# EasyEDA Pro project ProPrj_SuperCapTestBoard - 2.1_2024-07-26.epro, schematic Schematic2

## Sheets
1 P1: Create Date: 2024-05-25; Page Name: P1; Project Name: SuperCapTestBoard - 2.1; Schematic Name: Schematic2; Update Date: 2024-05-30; Company: EasyEDA.com; Drawed: EasyEDA Pro; Page Size: A4; Part Number: JLCPCB-002; Reviewed: EasyEDA Pro; Version: V0.1
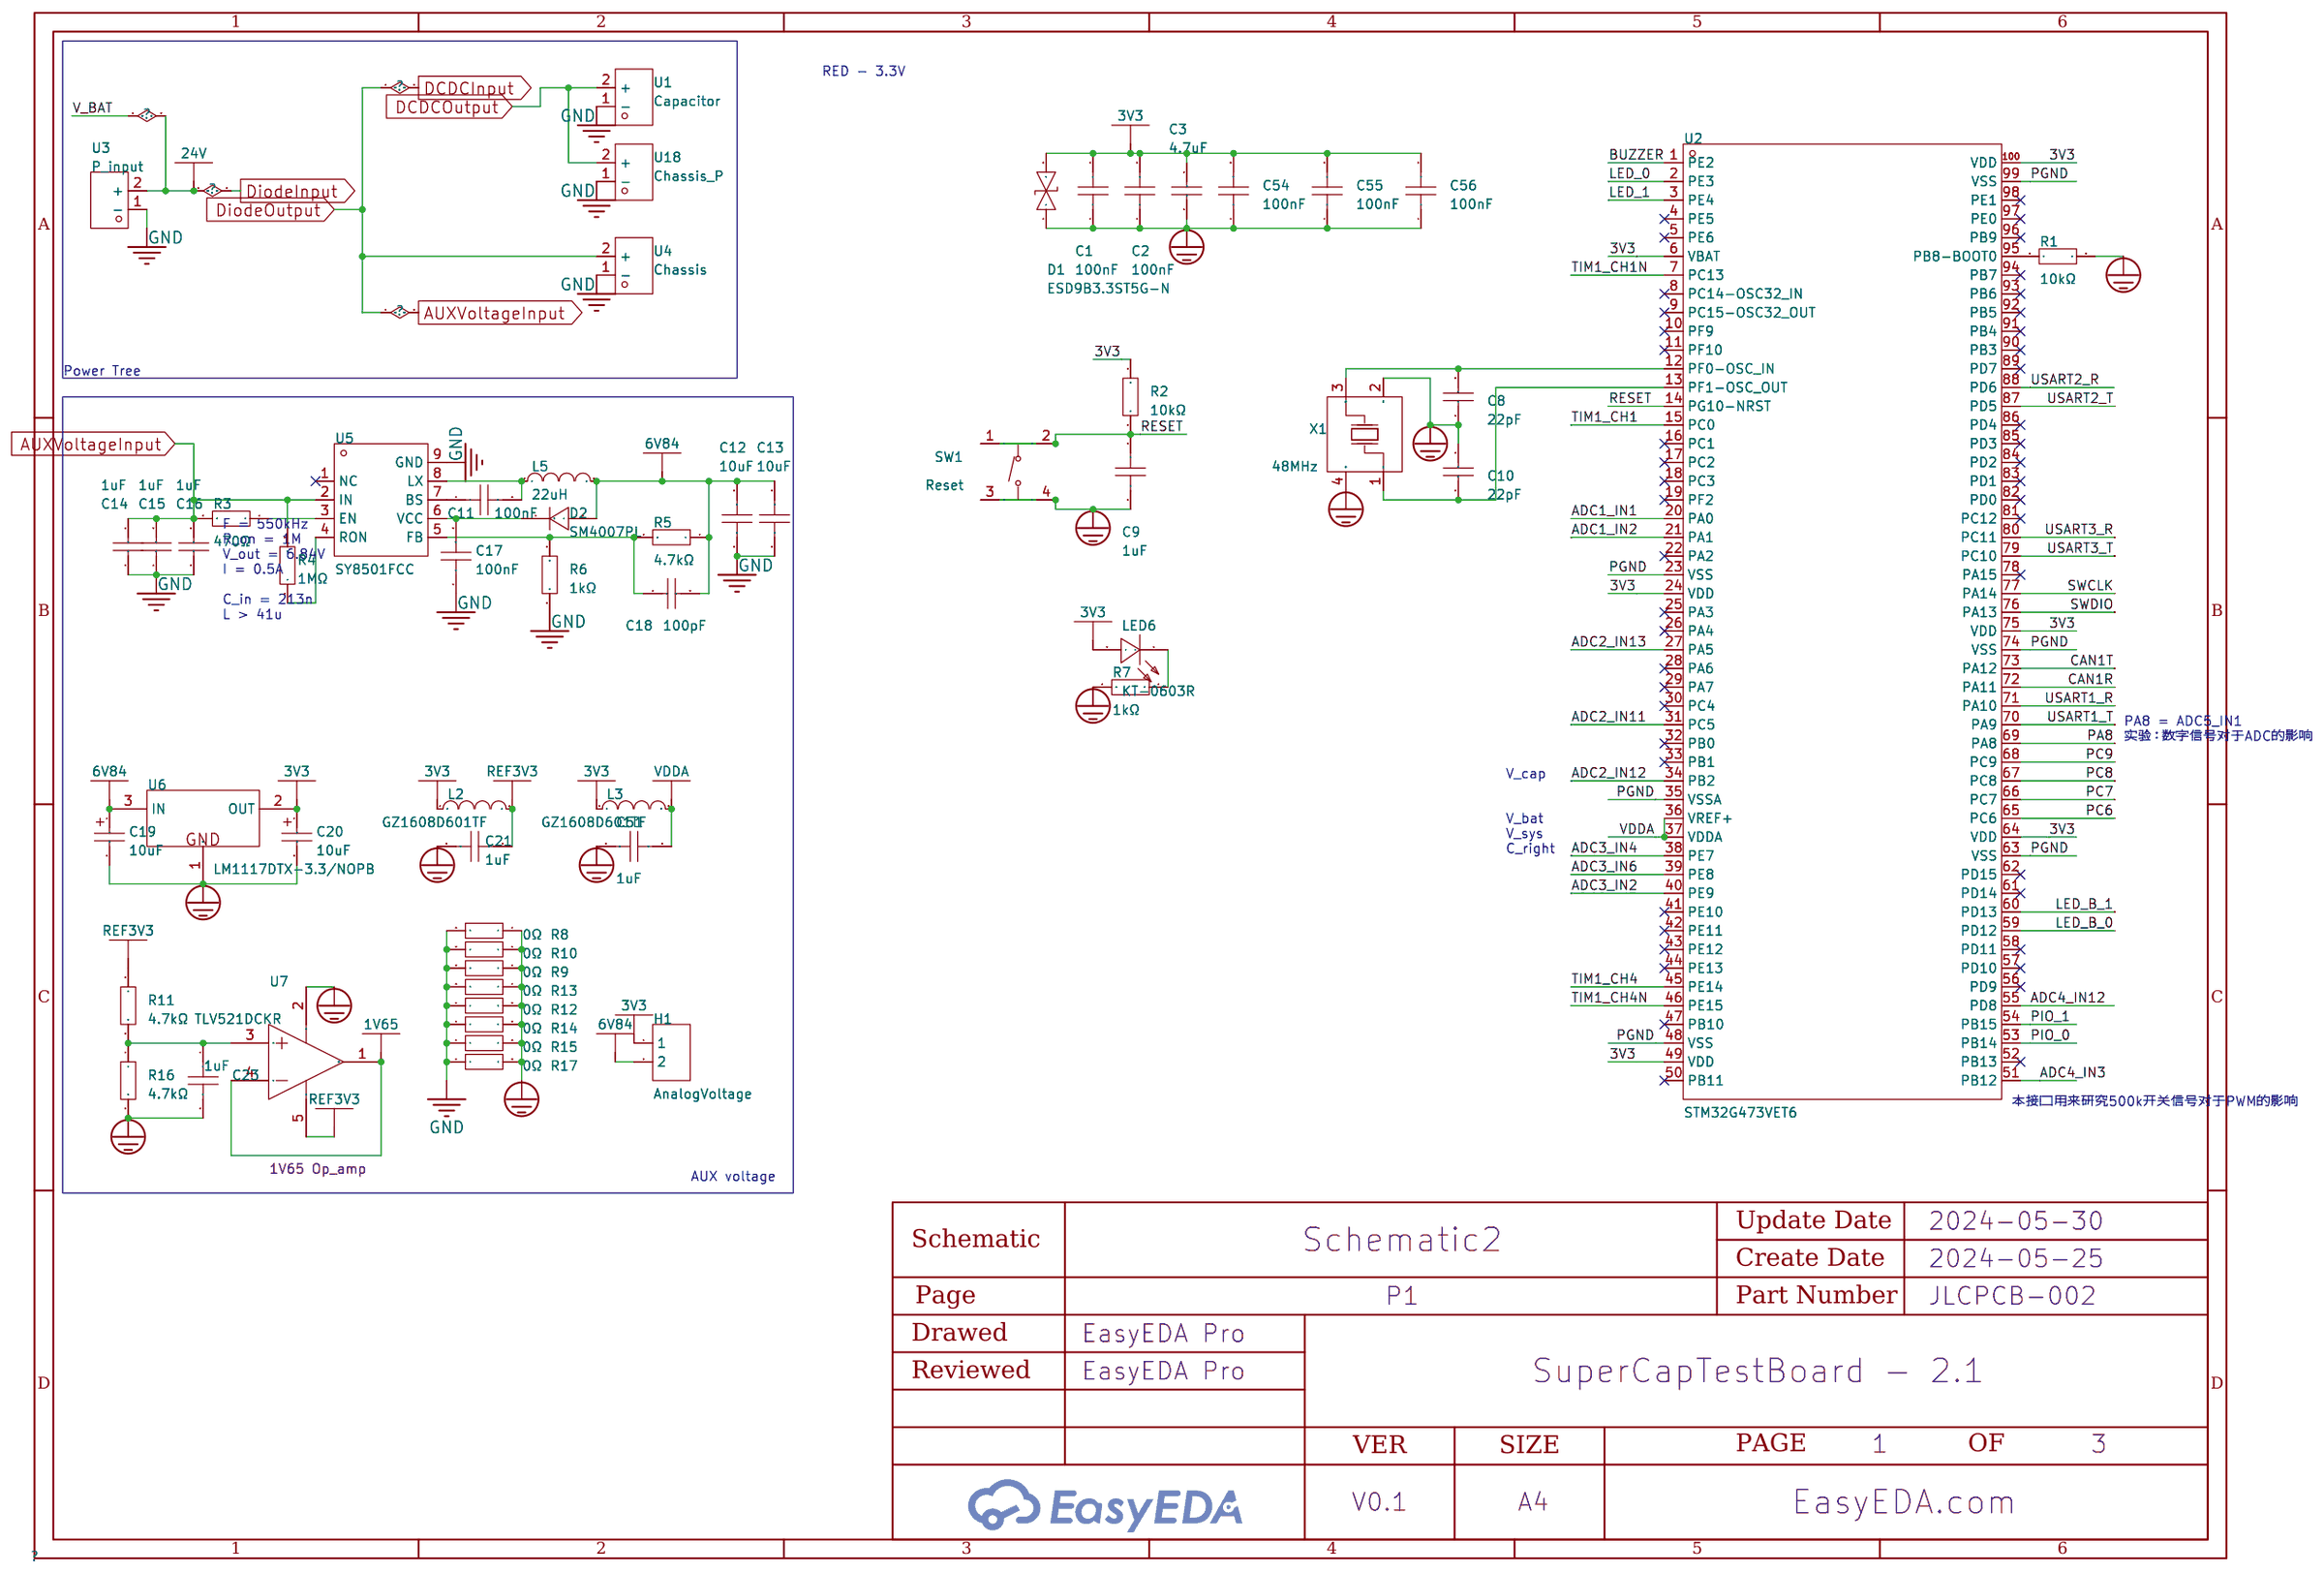
[diagram p0: P1]
2 P2: Page Name: P2.Schematic2; Update Date: 2024-05-31
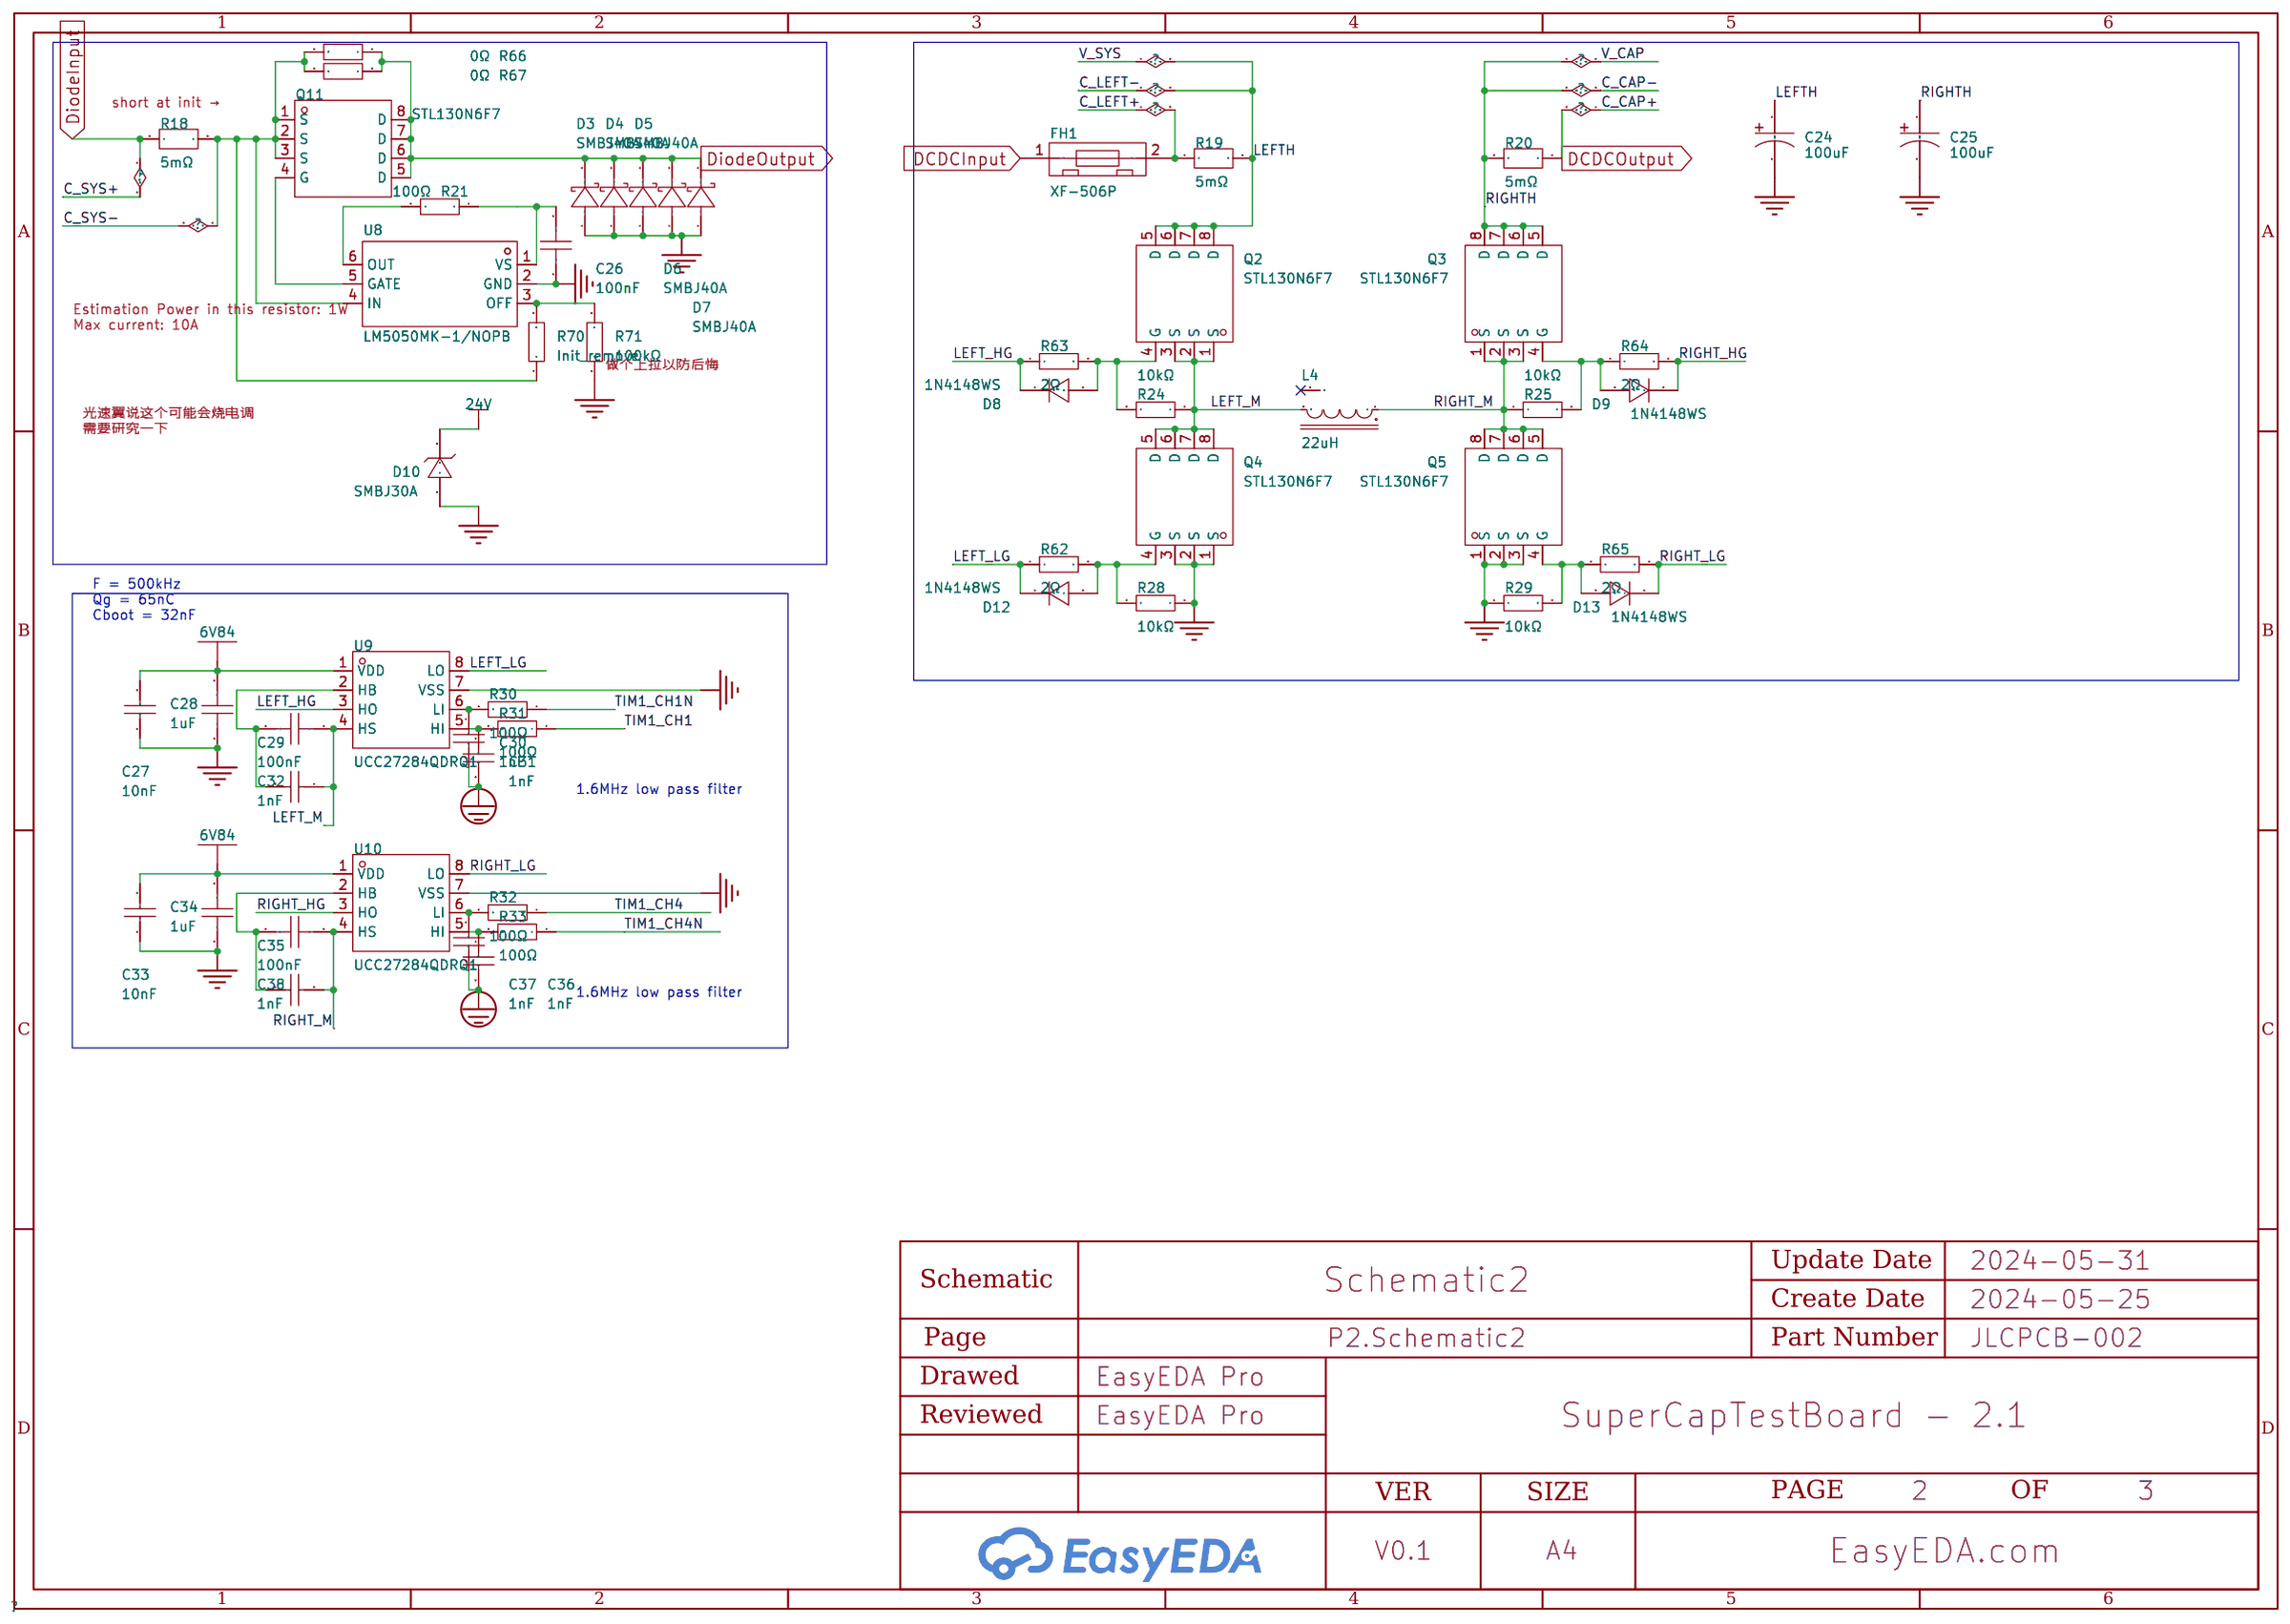
[diagram p1: P2]
3 P3: Page Name: P3; Update Date: 2024-05-24
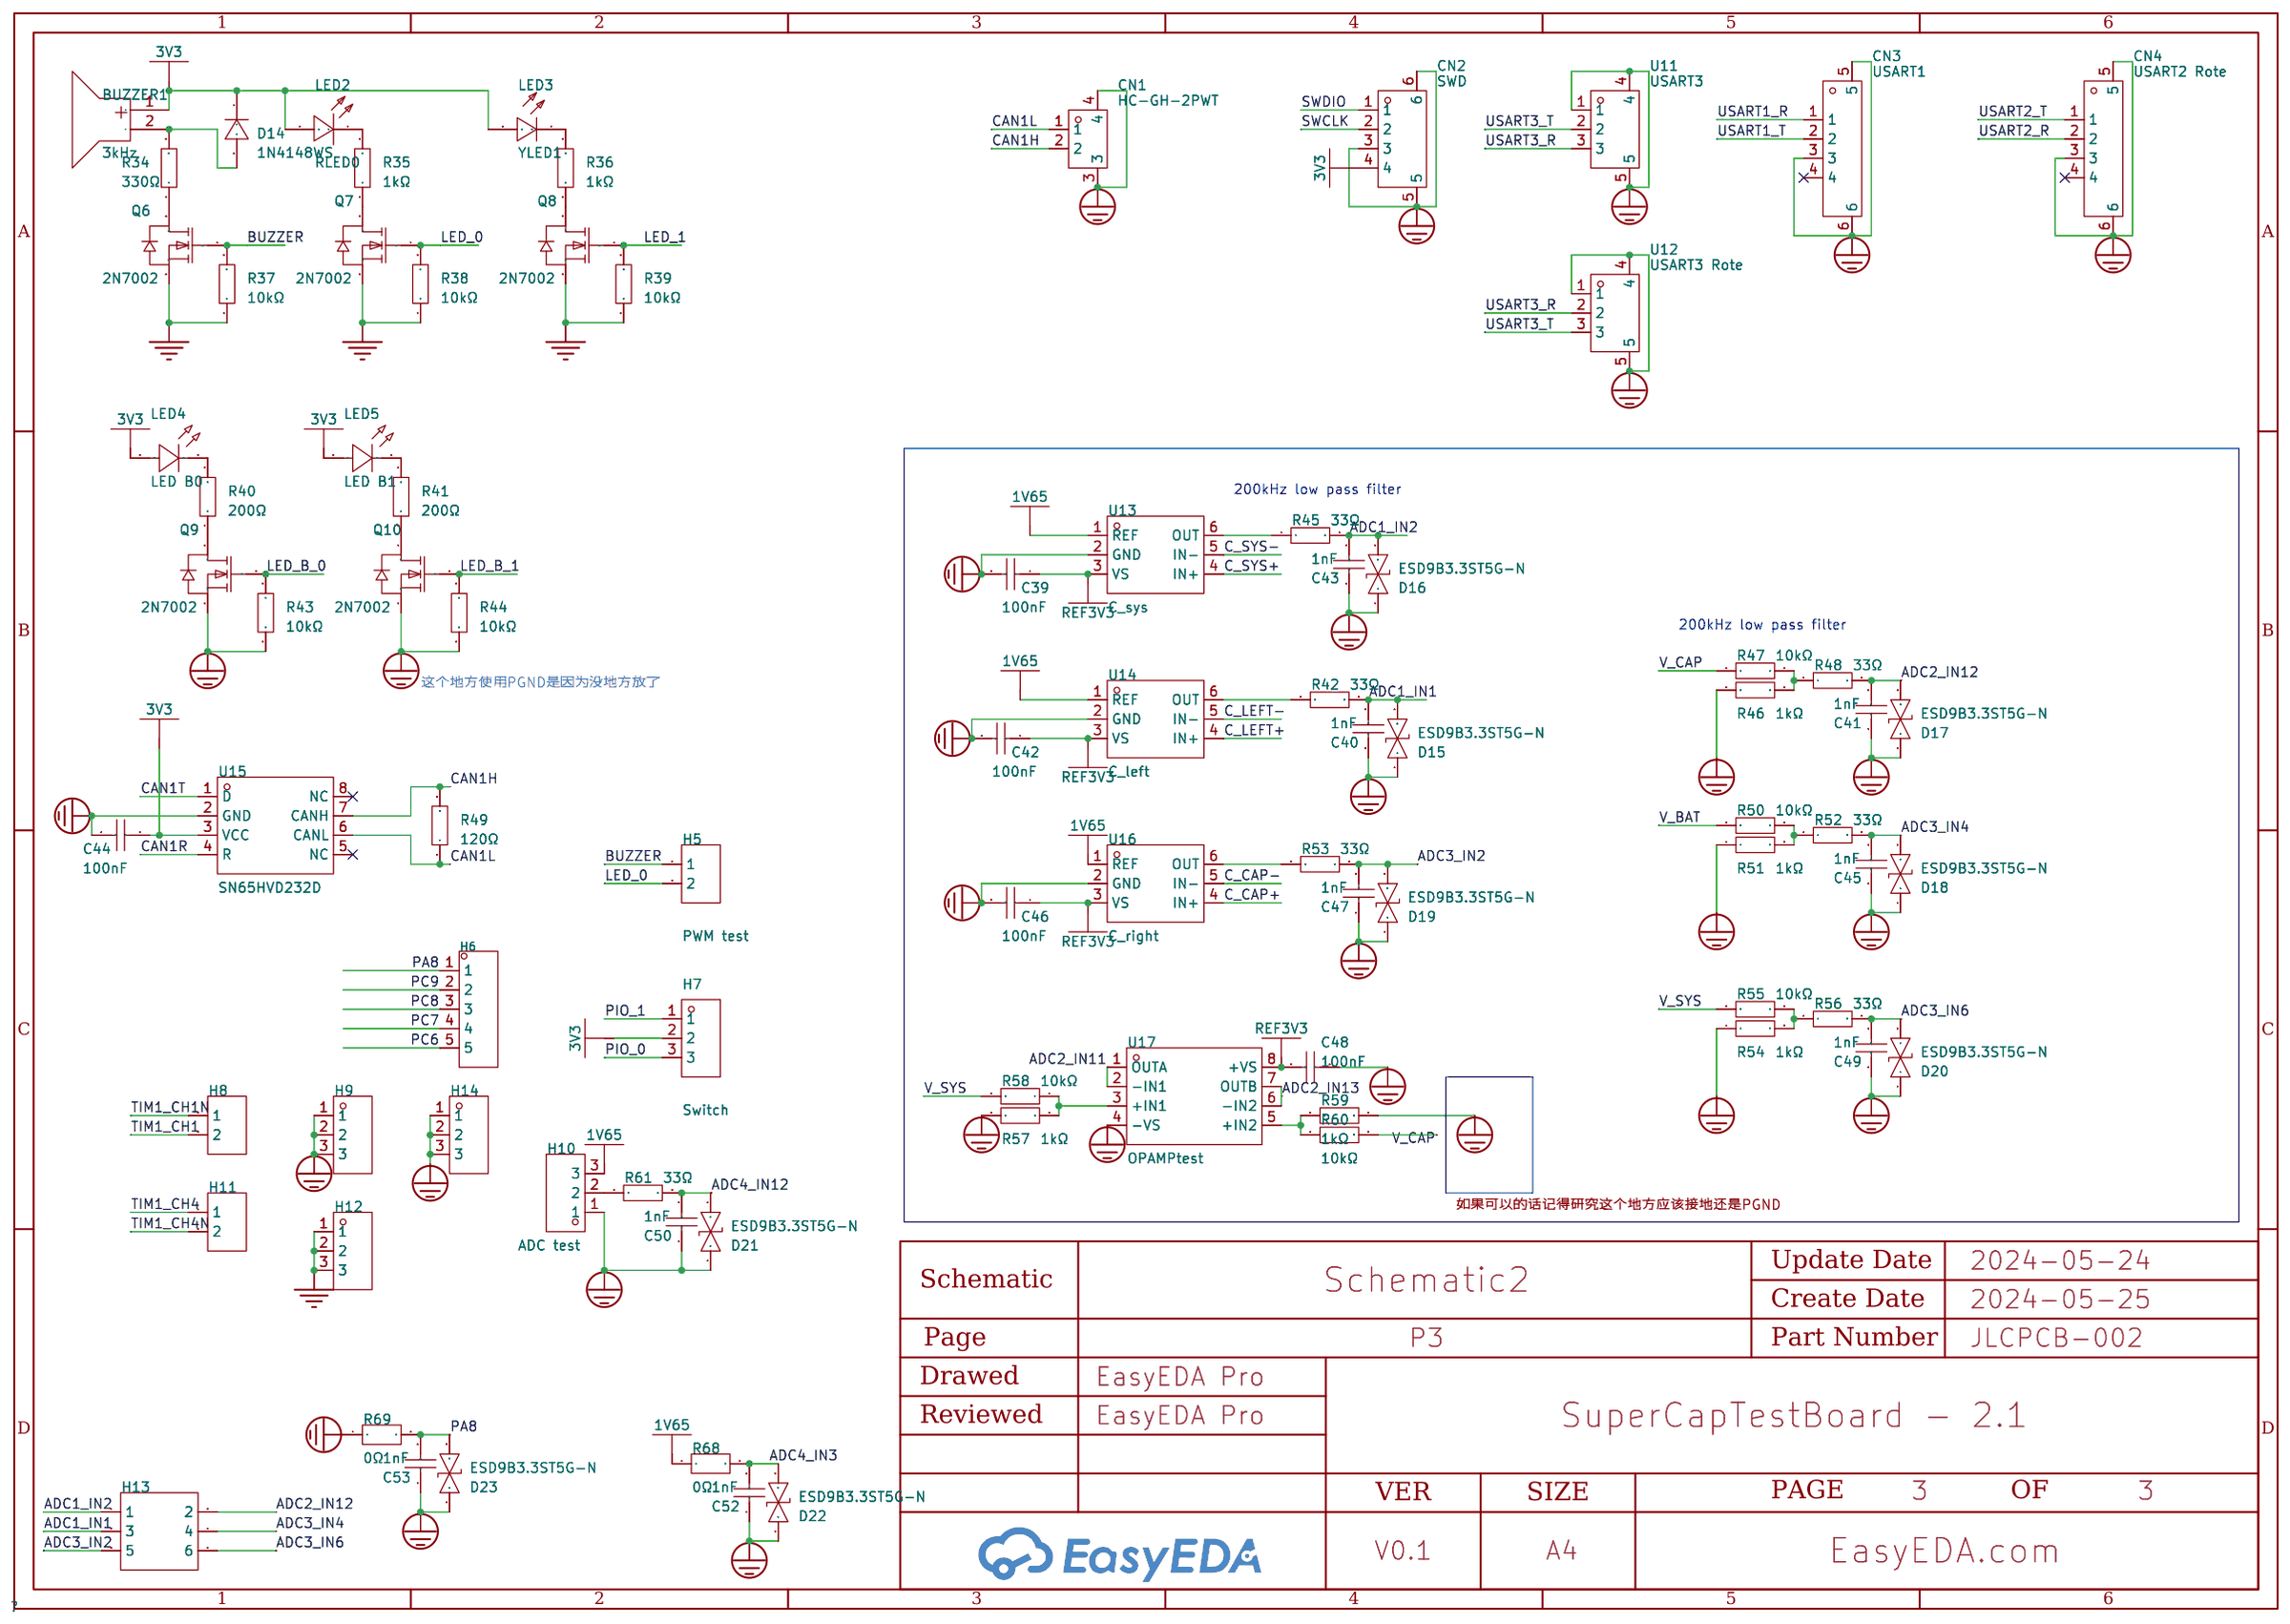
[diagram p2: P3]

## Parts
sheet P1
C1  100nF  [C0402]
C2  100nF  [C0402]
C3  4.7uF  [C0402]
C8  22pF  [C0402]
C9  1uF  [C0402]
C10  22pF  [C0402]
C11  100nF  [C0402]
C12  10uF  [C0603]
C13  10uF  [C0603]
C14  1uF  [R0805_NEW]
C15  1uF  [R0805_NEW]
C16  1uF  [R0805_NEW]
C17  100nF  [C0402]
C18  100pF  [C0402]
C19  10uF  [CAP-SMD_L3.2-W1.6-RD-C7171]
C20  10uF  [CAP-SMD_L3.2-W1.6-RD-C7171]
C21  1uF  [C0402]
C23  1uF  [C0402]
C51  1uF  [C0603]
C54  100nF  [C0402]
C55  100nF  [C0402]
C56  100nF  [C0402]
D1  ESD9B3.3ST5G-N  [DFN1006-2L-BI]
D2  SM4007PL  [SOD-123F_L2.8-W1.8-LS3.7-RD]
H1  AnalogVoltage  [HDR-TH_2P-P2.54-V-F]
L2  GZ1608D601TF  [R0603_NEW]
L3  GZ1608D601TF  [L0603]
L5  22uH  [IND-SMD_L4.0-W4.0]
LED6  KT-0603R  [LED0603-RD_WHITE]
R1  10kΩ  [R0402]
R2  10kΩ  [R0402]
R3  470Ω  [R0402]
R4  1MΩ  [R0402]
R5  4.7kΩ  [R0402]
R6  1kΩ  [R0402]
R7  1kΩ  [R0402]
R8  0Ω  [R0805]
R9  0Ω  [R0805]
R10  0Ω  [R0805]
R11  4.7kΩ  [R0402]
R12  0Ω  [R0805]
R13  0Ω  [R0805]
R14  0Ω  [R0805]
R15  0Ω  [R0805]
R16  4.7kΩ  [R0402]
R17  0Ω  [R0805]
SW1  Reset  [SW-SMD_4P-L5.1-W5.1-P3.70-LS6.5-TL-2]
U1  Capacitor  [CONN-TH_XT30U-F]
U2  STM32G473VET6  [LQFP-100_L14.0-W14.0-P0.50-LS16.0-BL]
U3  P_input  [CONN-TH_XT30U-F]
U4  Chassis  [CONN-TH_XT30U-F]
U5  SY8501FCC  [SO-8_L4.9-W3.9-P1.27-LS6.0-BL-EP]
U6  LM1117DTX-3.3/NOPB  [TO-252-2_L6.6-W6.1-P4.57-LS9.9-BR-CW]
U7  TLV521DCKR  [SC-70-5_L2.1-W1.3-P0.65-LS2.1-BR]
U18  Chassis_P  [CONN-TH_XT30U-F]
X1  48MHz  [CRYSTAL-SMD_4P-L3.2-W2.5-BL]
sheet P2
C24  100uF  [CAP-TH_BD8.0-P3.50-D0.6-FD]
C25  100uF  [CAP-TH_BD8.0-P3.50-D0.6-FD]
C26  100nF  [C0402]
C27  10nF  [C0402]
C28  1uF  [C0402]
C29  100nF  [C0402]
C30  1nF  [C0402]
C31  1nF  [C0402]
C32  1nF  [C0402]
C33  10nF  [C0402]
C34  1uF  [C0402]
C35  100nF  [C0402]
C36  1nF  [C0402]
C37  1nF  [C0402]
C38  1nF  [C0402]
D3  SMBJ40A  [SMB_L4.3-W3.6-LS5.4-R-RD]
D4  SMBJ40A  [SMB_L4.3-W3.6-LS5.4-R-RD]
D5  SMBJ40A  [SMB_L4.3-W3.6-LS5.4-R-RD]
D6  SMBJ40A  [SMB_L4.3-W3.6-LS5.4-R-RD]
D7  SMBJ40A  [SMB_L4.3-W3.6-LS5.4-R-RD]
D8  1N4148WS  [SOD-323_L1.8-W1.3-LS2.5-RD]
D9  1N4148WS  [SOD-323_L1.8-W1.3-LS2.5-RD]
D10  SMBJ30A  [SMB_L4.6-W3.6-LS5.3-RD]
D12  1N4148WS  [SOD-323_L1.8-W1.3-LS2.5-RD]
D13  1N4148WS  [SOD-323_L1.8-W1.3-LS2.5-RD]
FH1  XF-506P  [FUSE-TH_XF-506P]
L4  22uH  [IND-SMD_3P-L27.9-W19.7-P10.43-LS27.9-BL-A]
Q2  STL130N6F7  [POWERFLAT-8_L5.2-W6.0-P1.27-LS6.2-BL]
Q3  STL130N6F7  [POWERFLAT-8_L5.2-W6.0-P1.27-LS6.2-BL]
Q4  STL130N6F7  [POWERFLAT-8_L5.2-W6.0-P1.27-LS6.2-BL]
Q5  STL130N6F7  [POWERFLAT-8_L5.2-W6.0-P1.27-LS6.2-BL]
Q11  STL130N6F7  [POWERFLAT-8_L5.2-W6.0-P1.27-LS6.2-BL]
R18  5mΩ  [RES-SMD_L6.4-W3.2-1]
R19  5mΩ  [RES-SMD_L6.4-W3.2-1]
R20  5mΩ  [RES-SMD_L6.4-W3.2-1]
R21  100Ω  [R0402]
R24  10kΩ  [R0402]
R25  10kΩ  [R0402]
R28  10kΩ  [R0402]
R29  10kΩ  [R0402]
R30  100Ω  [R0402]
R31  100Ω  [R0402]
R32  100Ω  [R0402]
R33  100Ω  [R0402]
R62  2Ω  [R0402]
R63  2Ω  [R0402]
R64  2Ω  [R0402]
R65  2Ω  [R0402]
R66  0Ω  [R0805]
R67  0Ω  [R0805]
R70  100kΩ  [R0402]
R71  100kΩ  [R0402]
U8  LM5050MK-1/NOPB  [TSOT-23-6_L2.9-W1.6-P0.95-LS2.8-BR]
U9  UCC27284QDRQ1  [SOIC-8_L4.9-W3.9-P1.27-LS6.0-BL]
U10  UCC27284QDRQ1  [SOIC-8_L4.9-W3.9-P1.27-LS6.0-BL]
sheet P3
BUZZER1  3kHz  [BUZ-TH_BD9.0-P5.00-D0.6-FD]
C39  100nF  [C0402]
C40  1nF  [C0402]
C41  1nF  [C0402]
C42  100nF  [C0402]
C43  1nF  [C0402]
C44  100nF  [C0402]
C45  1nF  [C0402]
C46  100nF  [C0402]
C47  1nF  [C0402]
C48  100nF  [C0402]
C49  1nF  [C0402]
C50  1nF  [C0402]
C52  1nF  [C0402]
C53  1nF  [C0402]
CN1  HC-GH-2PWT  [CONN-SMD_2P-P1.25_HCTL_HC-GH-2PWTKK]
CN2  SWD  [CONN-SMD_4P-P1.25-HC-1.25-4PWT]
CN3  USART1  [CONN-SMD_HC-GH-4PWT]
CN4  USART2 Rote  [CONN-SMD_HC-GH-4PWT]
D14  1N4148WS  [SOD-323_L1.8-W1.3-LS2.5-RD]
D15  ESD9B3.3ST5G-N  [DFN1006-2L-BI]
D16  ESD9B3.3ST5G-N  [DFN1006-2L-BI]
D17  ESD9B3.3ST5G-N  [DFN1006-2L-BI]
D18  ESD9B3.3ST5G-N  [DFN1006-2L-BI]
D19  ESD9B3.3ST5G-N  [DFN1006-2L-BI]
D20  ESD9B3.3ST5G-N  [DFN1006-2L-BI]
D21  ESD9B3.3ST5G-N  [DFN1006-2L-BI]
D22  ESD9B3.3ST5G-N  [DFN1006-2L-BI]
D23  ESD9B3.3ST5G-N  [DFN1006-2L-BI]
H5  PWM test  [HDR-TH_2P-P2.54-V-F]
H6  -  [HDR-TH_5P-P2.54-V-M]
H7  Switch  [HDR-TH_3P-P2.54-V-M]
H8  -  [HDR-TH_2P-P2.54-V-F]
H9  -  [HDR-TH_3P-P2.54-V-M]
H10  ADC test  [HDR-TH_3P-P2.54-V-M]
H11  -  [HDR-TH_2P-P2.54-V-F]
H12  -  [HDR-TH_3P-P2.54-V-M]
H13  -  [HDR-TH_6P-P2.54-V-F-R2-C3-S2.54]
H14  -  [HDR-TH_3P-P2.54-V-M]
LED2  RLED0  [LED0603-RD_WHITE]
LED3  YLED1  [LED0603-RD_WHITE]
LED4  LED B0  [LED0805-RD_BLUE]
LED5  LED B1  [LED0805-RD_BLUE]
Q6  2N7002  [SOT-23-3_L2.9-W1.3-P1.90-LS2.4-BR]
Q7  2N7002  [SOT-23-3_L2.9-W1.3-P1.90-LS2.4-BR]
Q8  2N7002  [SOT-23-3_L2.9-W1.3-P1.90-LS2.4-BR]
Q9  2N7002  [SOT-23-3_L2.9-W1.3-P1.90-LS2.4-BR]
Q10  2N7002  [SOT-23-3_L2.9-W1.3-P1.90-LS2.4-BR]
R34  330Ω  [R0603]
R35  1kΩ  [R0402]
R36  1kΩ  [R0402]
R37  10kΩ  [R0402]
R38  10kΩ  [R0402]
R39  10kΩ  [R0402]
R40  200Ω  [R0402]
R41  200Ω  [R0402]
R42  33Ω  [R0402]
R43  10kΩ  [R0402]
R44  10kΩ  [R0402]
R45  33Ω  [R0402]
R46  1kΩ  [R0402]
R47  10kΩ  [R0402]
R48  33Ω  [R0402]
R49  120Ω  [R0603]
R50  10kΩ  [R0402]
R51  1kΩ  [R0402]
R52  33Ω  [R0402]
R53  33Ω  [R0402]
R54  1kΩ  [R0402]
R55  10kΩ  [R0402]
R56  33Ω  [R0402]
R57  1kΩ  [R0402]
R58  10kΩ  [R0402]
R59  1kΩ  [R0402]
R60  10kΩ  [R0402]
R61  33Ω  [R0402]
R68  0Ω  [R0603]
R69  0Ω  [R0603]
U11  USART3  [CONN-SMD_GH-3PWT]
U12  USART3 Rote  [CONN-SMD_GH-3PWT]
U13  C_sys  [SC-70-6_L2.2-W1.3-P0.65-LS2.1-BR]
U14  C_left  [SC-70-6_L2.2-W1.3-P0.65-LS2.1-BR]
U15  SN65HVD232D  [SOIC-8_L4.9-W3.9-P1.27-LS6.0-TL]
U16  C_right  [SC-70-6_L2.2-W1.3-P0.65-LS2.1-BR]
U17  OPAMPtest  [SOIC-8_L4.9-W3.9-P1.27-LS6.0-BL]

## Library data of the parts
C1 C2 C11 C17 C26 C29 C35 C54-C56 = CL05B104KB54PNC: 容值:100nF;精度:±10%;额定电压:50V;材质(温度系数):X7R;; LCSC Part Name: 100nF ±10% 50V; Supplier Part: C307331; Manufacturer: SAMSUNG(三星); Supplier Footprint: 0402; JLCPCB Part Class: 基础库; Datasheet: https://atta.szlcsc.com/upload/public/pdf/source/20160218/1457707763339.pdf; Supplier: LCSC; Tolerance: ±10%; Voltage Rated: 50V; Temperature Coefficient: X7R
C3 = CL05A475MP5NRNC: 容值:4.7uF;精度:±20%;额定电压:10V;材质(温度系数):X5R;; LCSC Part Name: 4.7uF ±20% 10V; Supplier Part: C23733; Manufacturer: SAMSUNG(三星); Supplier Footprint: 0402; JLCPCB Part Class: 基础库; Datasheet: https://atta.szlcsc.com/upload/public/pdf/source/20160218/1457707763339.pdf; Supplier: LCSC; Tolerance: ±20%; Voltage Rated: 10V; Temperature Coefficient: X5R
C8 C10 = 0402CG220J500NT: 容值:22pF;精度:±5%;额定电压:50V;材质(温度系数):C0G;; LCSC Part Name: 22pF ±5% 50V; Supplier Part: C1555; Manufacturer: FH(风华); Supplier Footprint: 0402; JLCPCB Part Class: 基础库; Datasheet: https://atta.szlcsc.com/upload/public/pdf/source/20200305/C486355_26A10D38EF8C2A5C37091D0039909270.pdf; Supplier: LCSC; Tolerance: ±5%; Voltage Rated: 50V; Temperature Coefficient: C0G
C9 C21 C23 C28 C34 = CL05A105KA5NQNC: 容值:1uF;精度:±10%;额定电压:25V;材质(温度系数):X5R;; LCSC Part Name: 1uF ±10% 25V; Supplier Part: C52923; Manufacturer: SAMSUNG(三星); Supplier Footprint: 0402; JLCPCB Part Class: 基础库; Datasheet: https://atta.szlcsc.com/upload/public/pdf/source/20160218/1457707763339.pdf; Supplier: LCSC; Tolerance: ±10%; Voltage Rated: 25V; Temperature Coefficient: X5R
C12 C13 = CL10A106MA8NRNC: 容值:10uF;精度:±20%;额定电压:25V;材质(温度系数):X5R;; LCSC Part Name: 10uF ±20% 25V; Supplier Part: C96446; Manufacturer: SAMSUNG(三星); Supplier Footprint: 0603; JLCPCB Part Class: 基础库; Datasheet: https://atta.szlcsc.com/upload/public/pdf/source/20160218/1457707763339.pdf; Supplier: LCSC; Tolerance: ±20%; Voltage Rated: 25V; Temperature Coefficient: X5R
C14-C16 = CL21B105KBFNNNE: 容值:1uF;精度:±10%;额定电压:50V;材质(温度系数):X7R;; LCSC Part Name: 1uF ±10% 50V; Supplier Part: C28323; Manufacturer: SAMSUNG(三星); Supplier Footprint: 0805; JLCPCB Part Class: 基础库; Datasheet: https://atta.szlcsc.com/upload/public/pdf/source/20160218/1457707763339.pdf; Supplier: LCSC; Tolerance: ±10%; Voltage Rated: 50V; Temperature Coefficient: X7R
C18 = 0402CG101J500NT: 容值:100pF;精度:±5%;额定电压:50V;材质(温度系数):C0G;; LCSC Part Name: 100pF ±5% 50V; Supplier Part: C1546; Manufacturer: FH(风华); Supplier Footprint: 0402; JLCPCB Part Class: Basic Part; Datasheet: https://atta.szlcsc.com/upload/public/pdf/source/20200305/C486355_26A10D38EF8C2A5C37091D0039909270.pdf; Supplier: LCSC; Tolerance: ±5%; Voltage Rated: 50V; Temperature Coefficient: C0G
C19 C20 = TAJA106K016RNJ: 容值:10uF;精度:±10%;额定电压:16V;等效串联电阻:3Ω@100kHz;; LCSC Part Name: 10uF ±10% 16V; Supplier Part: C7171; Manufacturer: Kyocera AVX; Supplier Footprint: CASE-A-3216; JLCPCB Part Class: 基础库; Datasheet: https://atta.szlcsc.com/upload/public/pdf/source/20160107/1457707750344.pdf; Supplier: LCSC; Tolerance: ±10%; Rated Voltage: 16V; Equivalent Series Resistance(ESR): 3Ω@100kHz; Operating Temperature: -55℃~+125℃
C51 = CL10A105KB8NNNC: 容值:1uF;精度:±10%;额定电压:50V;材质(温度系数):X5R;; LCSC Part Name: 1uF ±10% 50V; Supplier Part: C15849; Manufacturer: SAMSUNG(三星); Supplier Footprint: 0603; JLCPCB Part Class: 基础库; Datasheet: https://atta.szlcsc.com/upload/public/pdf/source/20160218/1457707763339.pdf; Supplier: LCSC; Tolerance: ±10%; Voltage Rated: 50V; Temperature Coefficient: X5R
D1 D15-D23 = ESD9B3.3ST5G-N: 反向截止电压(Vrwm):3.3V@Max;最大钳位电压:8V;峰值脉冲电流(Ipp)@10/1000us:10A@8/20us;击穿电压:3.8V;; LCSC Part Name: 双向TVS 3.3V截止 10A峰值脉冲; Supplier Part: C316039; Manufacturer: BORN(伯恩半导体); Supplier Footprint: DFN1006-2; JLCPCB Part Class: 扩展库; Datasheet: https://atta.szlcsc.com/upload/public/pdf/source/20181105/C316039_0D8D1D54B0EEBDD90CD63BF8C2461619.pdf; Supplier: LCSC; Reverse Stand-Off Voltage (Vrwm): 3.3V@Max; Maximum Clamping Voltage: 8V; Peak Pulse Current (Ipp)@10/1000us: 10A@8/20us; Breakdown Voltage: 3.8V; Type: TVS
D2 = SM4007PL_C64898: 二极管配置:-;正向压降(Vf):1.1V@1A;直流反向耐压(Vr):1kV;平均整流电流(Io):1A;; LCSC Part Name: 电压:1kV 电流:1A; Supplier Part: C64898; Manufacturer: MDD; Supplier Footprint: SOD-123FL; JLCPCB Part Class: 基础库; Datasheet: https://atta.szlcsc.com/upload/public/pdf/source/20230823/16A8FDE162764C9B685A3717F2DA3690.pdf; Supplier: LCSC; Forward Voltage (Vf@If): 1.1V@1A; Reverse Voltage (Vr): 1kV; Average Rectified Current (Io): 1A; Reverse Leakage Current: 10uA@1kV
H1 H5 H8 H11 = HDR-F_2.54_1x2P: Supplier Part: C49661; Supplier Footprint: 插件
L2 L3 = GZ1608D601TF: 标称阻抗@测试频率:600Ω@100MHz;误差:±25%;直流电阻(RDC):450mΩ;; LCSC Part Name: 单路 0603磁珠 阻抗600Ω@100MHz; Supplier Part: C1002; Manufacturer: Sunlord(顺络); Supplier Footprint: 0603; JLCPCB Part Class: 基础库; Datasheet: https://atta.szlcsc.com/upload/public/pdf/source/20231030/9B6A3E87682CEC1FF6638DFAA81D73FA.pdf; Supplier: LCSC; Impedance @ Frequency: 600Ω@100MHz; Tolerance: ±25%; DC Resistance: 450mΩ; Current Rating: 200mA; Circuits: 1
L5 = YNR4030-220M: 电感值:22uH;精度:±20%;额定电流:1A;; LCSC Part Name: 22uH ±20%; Supplier Part: C341013; Manufacturer: YJYCOIN(益嘉源); Supplier Footprint: SMD,4x4x3mm; JLCPCB Part Class: 扩展库; Datasheet: https://atta.szlcsc.com/upload/public/pdf/source/20200623/C340386_9AA10DB3E9692149FF2BB278AFBCE083.pdf; Supplier: LCSC; Tolerance: ±20%; Rated Current: 1A; DC Resistance (DCR): 225mΩ
LED2 LED6 = KT-0603R: 发光颜色:红色;功率:-;正向电流:-;主波长:-;二极管配置:-;透镜颜色:-;色温:-;发光角度:-;载带方式:-;工作温度:-40℃~+85℃;; LCSC Part Name: 0603 红灯 高亮; Supplier Part: C2286; Manufacturer: KENTO; Supplier Footprint: 0603; JLCPCB Part Class: 基础库; Datasheet: https://atta.szlcsc.com/upload/public/pdf/source/20160616/1466072038404.pdf; Supplier: LCSC; Emitted Color: 红色; Operating Temperature: -40℃~+85℃
R1 R2 R24 R25 R28 R29 R37-R39 R43 R44 R47 R50 R55 R58 R60 = 0402WGF1002TCE: 电阻类型:厚膜电阻;阻值:10kΩ;精度:±1%;功率:62.5mW;最大工作电压:50V;温度系数:±100ppm/℃;; LCSC Part Name: 10kΩ ±1% 62.5mW 厚膜电阻; Supplier Part: C25744; Manufacturer: UNI-ROYAL(厚声); Supplier Footprint: 0402; JLCPCB Part Class: 基础库; Datasheet: https://atta.szlcsc.com/upload/public/pdf/source/20200306/C422600_1E6D84923E4A46A82E41ADD87F860B5C.pdf; Supplier: LCSC; Type: 厚膜电阻; Tolerance: ±1%; Power(Watts): 62.5mW; Overload Voltage (Max): 50V; Temperature Coefficient: ±100ppm/℃; Operating Temperature Range: -55℃~+155℃
R3 = 0402WGF4700TCE: 电阻类型:厚膜电阻;阻值:470Ω;精度:±1%;功率:62.5mW;最大工作电压:50V;温度系数:±100ppm/℃;; LCSC Part Name: 470Ω ±1% 62.5mW 厚膜电阻; Supplier Part: C25117; Manufacturer: UNI-ROYAL(厚声); Supplier Footprint: 0402; JLCPCB Part Class: 基础库; Datasheet: https://atta.szlcsc.com/upload/public/pdf/source/20200306/C422600_1E6D84923E4A46A82E41ADD87F860B5C.pdf; Supplier: LCSC; Type: 厚膜电阻; Tolerance: ±1%; Power(Watts): 62.5mW; Overload Voltage (Max): 50V; Temperature Coefficient: ±100ppm/℃; Operating Temperature Range: -55℃~+155℃
R4 = 0402WGF1004TCE: 电阻类型:厚膜电阻;阻值:1MΩ;精度:±1%;功率:62.5mW;最大工作电压:50V;温度系数:±100ppm/℃;; LCSC Part Name: 1MΩ ±1% 62.5mW 厚膜电阻; Supplier Part: C26083; Manufacturer: UNI-ROYAL(厚声); Supplier Footprint: 0402; JLCPCB Part Class: 基础库; Datasheet: https://atta.szlcsc.com/upload/public/pdf/source/20200306/C422600_1E6D84923E4A46A82E41ADD87F860B5C.pdf; Supplier: LCSC; Type: 厚膜电阻; Tolerance: ±1%; Power(Watts): 62.5mW; Overload Voltage (Max): 50V; Temperature Coefficient: ±100ppm/℃; Operating Temperature Range: -55℃~+155℃
R5 R11 R16 = 0402WGF4701TCE: 电阻类型:厚膜电阻;阻值:4.7kΩ;精度:±1%;功率:62.5mW;最大工作电压:50V;温度系数:±100ppm/℃;; LCSC Part Name: 4.7kΩ ±1% 62.5mW 厚膜电阻; Supplier Part: C25900; Manufacturer: UNI-ROYAL(厚声); Supplier Footprint: 0402; JLCPCB Part Class: 基础库; Datasheet: https://atta.szlcsc.com/upload/public/pdf/source/20200306/C422600_1E6D84923E4A46A82E41ADD87F860B5C.pdf; Supplier: LCSC; Type: 厚膜电阻; Tolerance: ±1%; Power(Watts): 62.5mW; Overload Voltage (Max): 50V; Temperature Coefficient: ±100ppm/℃; Operating Temperature Range: -55℃~+155℃
R6 R7 R35 R36 R46 R51 R54 R57 R59 = 0402WGF1001TCE: 电阻类型:厚膜电阻;阻值:1kΩ;精度:±1%;功率:62.5mW;最大工作电压:50V;温度系数:±100ppm/℃;; LCSC Part Name: 1kΩ ±1% 62.5mW 厚膜电阻; Supplier Part: C11702; Manufacturer: UNI-ROYAL(厚声); Supplier Footprint: 0402; JLCPCB Part Class: 基础库; Datasheet: https://atta.szlcsc.com/upload/public/pdf/source/20200306/C422600_1E6D84923E4A46A82E41ADD87F860B5C.pdf; Supplier: LCSC; Type: 厚膜电阻; Tolerance: ±1%; Power(Watts): 62.5mW; Overload Voltage (Max): 50V; Temperature Coefficient: ±100ppm/℃; Operating Temperature Range: -55℃~+155℃
R8-R10 R12-R15 R17 R66 R67 = 0805W8F0000T5E: 电阻类型:厚膜电阻;阻值:0Ω;精度:±1%;功率:125mW;最大工作电压:150V;温度系数:±800ppm/℃;; LCSC Part Name: 0Ω ±1% 125mW 厚膜电阻; Supplier Part: C17477; Manufacturer: UNI-ROYAL(厚声); Supplier Footprint: 0805; JLCPCB Part Class: 基础库; Datasheet: https://atta.szlcsc.com/upload/public/pdf/source/20200306/C422600_1E6D84923E4A46A82E41ADD87F860B5C.pdf; Supplier: LCSC; Type: 厚膜电阻; Tolerance: ±1%; Power(Watts): 125mW; Overload Voltage (Max): 150V; Temperature Coefficient: ±800ppm/℃; Operating Temperature Range: -55℃~+155℃
SW1 = TS-1187A-B-A-B: 电路结构:单刀单掷;按钮形状:圆形按钮;作用力:160gf;安装方式:立贴;开关长度:5.1mm;开关宽度:5.1mm;开关高度:1.5mm;带支架:不带;触点电流:50mA;额定电压(DC):12V;绝缘电阻:-;带灯:无;机械寿命:10万次;; LCSC Part Name: 5.1*5.1*1.5mm 立贴 轻触开关; Supplier Part: C318884; Manufacturer: XKB Connectivity(中国星坤); Supplier Footprint: SMD; JLCPCB Part Class: Basic Part; Datasheet: https://atta.szlcsc.com/upload/public/pdf/source/20200227/C318890_053E50208A88A7BA1965D8746000774E.pdf; Supplier: LCSC; Circuit: 单刀单掷; Actuator Style: 圆形按钮; Operating Force: 160gf; Mounting Style: 立贴; Switch Length: 5.1mm; Switch Width: 5.1mm; Switch Height: 1.5mm; Strike Gundam: 不带; Contact Current: 50mA; Voltage Rating (DC): 12V; Actuator/Cap Color: 金色; With Lamp: 无; Mechanical Life: 10万次; Operating Temperature: -30℃~+85℃
U1 U3 U4 U18 = XT30U-F: 类别:-;类型1:-;; LCSC Part Name: AMASS(艾迈斯)轻量版锂电池插头母头 XT30U-F; Supplier Part: C99102; Manufacturer: AMASS(艾迈斯); JLCPCB Part Class: 扩展库; Datasheet: https://atta.szlcsc.com/upload/public/pdf/source/20190916/C428721_B0ECB8C5937139CEFE8736D2D3175B0E.pdf; Supplier: LCSC; Brand: 艾迈斯; Type: 插头; Colour: 黄色; InterfaceType: 母头
U2 = STM32G473VET6: CPU内核:CM4;程序存储容量:512KB;RAM总容量:128KB;GPIO端口数量:86;工作电压范围:1.71V~3.6V;CPU最大主频:170MHz;程序存储器类型:FLASH;; Supplier Part: C730122; Manufacturer: ST(意法半导体); Supplier Footprint: LQFP-100(14x14); JLCPCB Part Class: 扩展库; Datasheet: https://atta.szlcsc.com/upload/public/pdf/source/20200902/C730111_19331807E2800E1C1C13BFFAAC550E20.pdf; Supplier: LCSC; CPU Core: CM4; Program Storage Size: 512KB; RAM Size: 128KB; GPIO Ports Number: 86; Operating Voltage Range: 1.71V~3.6V; CPU Maximum Speed: 170MHz; Program Memory Type: FLASH; Operating Temperature Range: -40℃~+85℃; ADC (Bit): 12bit; DAC (Bit): 12bit; Peripheral/Function: PWM；PWM; Internal Oscillator: 有
U5 = SY8501FCC: Supplier Part: C365714; Manufacturer: silergy(矽力杰); Supplier Footprint: SO-8-EP; JLCPCB Part Class: 扩展库; Datasheet: https://atta.szlcsc.com/upload/public/pdf/source/20190322/C365714_219A6278F83EB450AA6BA842D4F40851.pdf; Supplier: LCSC
U6 = LM1117DTX-3.3/NOPB: Supplier Part: C78471; Supplier Footprint: TO-252-2(DPAK); JLCPCB Part Class: 扩展库; Datasheet: https://atta.szlcsc.com/upload/public/pdf/source/20160718/1468827476469.pdf; Supplier: LCSC
U7 = TLV521DCKR: 1V65 Op_amp; Supplier Part: C655085; Manufacturer: TI(德州仪器); Supplier Footprint: SC-70-5; JLCPCB Part Class: 扩展库; Datasheet: https://atta.szlcsc.com/upload/public/pdf/source/20230221/E2B5CB4AD3C2600A011813BFD55EDD6A.pdf; Supplier: LCSC
X1 = X322548MSB4SI: 晶振类型:贴片晶振;频率:48MHz;常温频差:±10ppm;外接负载电容:20pF;频率稳定度(全温):±20ppm;; LCSC Part Name: 48MHz ±10ppm 20pF; Supplier Part: C70579; Manufacturer: YXC(扬兴晶振); Supplier Footprint: SMD3225-4P; JLCPCB Part Class: 扩展库; Datasheet: https://atta.szlcsc.com/upload/public/pdf/source/20240329/19D5F850207469550BEB00D7DFEDBC7A.pdf; Supplier: LCSC; Crystal Type: 贴片晶振; Normal temperature Frequency Tolerance: ±10ppm; External load capacitor: 20pF; Frequency Stability(Full temperature range): ±20ppm; Operating Temperature: -40℃~+85℃
C24 C25 = SPZ1HM101F09O00RAXXX: 容值:100uF;精度:±20%;额定电压:50V;纹波电流:2.1A@100kHz;等效串联电阻:40mΩ@100kHz;类型:-;; LCSC Part Name: 100uF ±20% 50V; Supplier Part: C171434; Manufacturer: AISHI(艾华集团); Supplier Footprint: 插件,D8xL9mm; JLCPCB Part Class: 扩展库; Datasheet: https://atta.szlcsc.com/upload/public/pdf/source/20180111/C171434_15156662769471259234.pdf; Supplier: LCSC; Tolerance: ±20%; Rated Voltage: 50V; Ripple Current: 2.1A@100kHz; Equivalent Series Resistance(ESR): 40mΩ@100kHz; Lead Spacing: 3.5mm; φD: 8mm; L: 9mm; Lifetime @ Temp: 2000hrs@105℃; Operating Temperature: -55℃~+105℃
C27 C33 = CL05B103KB5NNNC: 容值:10nF;精度:±10%;额定电压:50V;材质(温度系数):X7R;; LCSC Part Name: 10nF ±10% 50V; Supplier Part: C15195; Manufacturer: SAMSUNG(三星); Supplier Footprint: 0402; JLCPCB Part Class: 基础库; Datasheet: https://atta.szlcsc.com/upload/public/pdf/source/20160218/1457707763339.pdf; Supplier: LCSC; Tolerance: ±10%; Voltage Rated: 50V; Temperature Coefficient: X7R
C30-C32 C36-C38 C40 C41 C43 C45 C47 C49 C50 C52 C53 = 0402B102K500NT: 容值:1nF;精度:±10%;额定电压:50V;材质(温度系数):X7R;; LCSC Part Name: 1nF ±10% 50V; Supplier Part: C1523; Manufacturer: FH(风华); Supplier Footprint: 0402; JLCPCB Part Class: Basic Part; Datasheet: https://atta.szlcsc.com/upload/public/pdf/source/20200305/C486355_26A10D38EF8C2A5C37091D0039909270.pdf; Supplier: LCSC; Tolerance: ±10%; Voltage Rated: 50V; Temperature Coefficient: X7R
D3-D7 = SMBJ40A_C2891329: 反向截止电压(Vrwm):40V;最大钳位电压:64.5V;峰值脉冲电流(Ipp)@10/1000us:9.3A;击穿电压:44.4V;; Supplier Part: C2891329; Manufacturer: GOODWORK(固得沃克); Supplier Footprint: SMB(DO-214AA); JLCPCB Part Class: 扩展库; Datasheet: https://atta.szlcsc.com/upload/public/pdf/source/20210903/0D959016F1EC8BC1C6EC67B4DA5150AF.pdf; Supplier: LCSC; Reverse Stand-Off Voltage (Vrwm): 40V; Maximum Clamping Voltage: 64.5V; Peak Pulse Current (Ipp)@10/1000us: 9.3A; Breakdown Voltage: 44.4V; Reverse Leakage Current (Ir): 5uA; Type: TVS
D8 D9 D12-D14 = 1N4148WS_C2128: 二极管配置:独立式;正向压降(Vf):1.25V@150mA;直流反向耐压(Vr):100V;平均整流电流(Io):150mA;功率:200mW;反向恢复时间(trr):4ns;; LCSC Part Name: 电压:100V 电流:150mA; Supplier Part: C2128; Manufacturer: CJ(江苏长电/长晶); Supplier Footprint: SOD-323; JLCPCB Part Class: 基础库; Datasheet: https://atta.szlcsc.com/upload/public/pdf/source/20140809/1457707208178.pdf; Supplier: LCSC; Diode Configuration: 独立式; Forward Voltage (Vf@If): 1.25V@150mA; Reverse Voltage (Vr): 100V; Average Rectified Current (Io): 150mA; Power Dissipation: 200mW; Reverse Leakage Current: 1uA@75V; Reverse Recovery Time (trr): 4ns
D10 = SMBJ30A_C726833: 极性：单向 反向截止电压(Vrwm)：30V 击穿电压：33.3V 最大钳位电压：48.4V; Supplier Part: C726833; Manufacturer: TWGMC(台湾迪嘉); Supplier Footprint: SMB; JLCPCB Part Class: 扩展库; Datasheet: https://atta.szlcsc.com/upload/public/pdf/source/20200901/C726811_07201DC3516E92FF13903A0BAE18F725.pdf; Supplier: LCSC
FH1 = XF-506P: 保险丝座类型:-;电路数:-;保险丝类型:-;; LCSC Part Name: 小型汽车插片保险丝座 2P2PIN/位; Supplier Part: C492610; Manufacturer: XFCN(兴飞); Supplier Footprint: 插件; JLCPCB Part Class: 扩展库; Datasheet: https://atta.szlcsc.com/upload/public/pdf/source/20210803/DF0095FE142D3C1FC63058D966D7448A.pdf; Supplier: LCSC; Voltage Rating: 250V; Current Rating: 15A
L4 = FC-SE2918-220M: 电感值:22uH;精度:±20%;额定电流:30A;饱和电流(Isat):15A;类型:-;; LCSC Part Name: 22uH ±20% 15A; Supplier Part: C2962789; Manufacturer: FC(方成); Supplier Footprint: SMD; JLCPCB Part Class: 扩展库; Datasheet: https://atta.szlcsc.com/upload/public/pdf/source/20230712/96DF22DB850A53D8EF9E65329083AA7B.pdf; Supplier: LCSC; Tolerance: ±20%; Rated Current: 30A; Saturation Current (Isat): 15A; DC Resistance (DCR): 2.6mΩ
Q2-Q5 Q11 = STL130N6F7: 类型:N沟道;漏源电压(Vdss):60V;连续漏极电流(Id):130A;功率(Pd):4.8W；125W;导通电阻(RDS(on)@Vgs,Id):3.5mΩ@13A,10V;阈值电压(Vgs(th)@Id):4V@250uA;; LCSC Part Name: N沟道 耐压:60V 电流:130A; Supplier Part: C501008; Manufacturer: ST(意法半导体); Supplier Footprint: PowerFLAT-5x6; JLCPCB Part Class: 扩展库; Datasheet: https://atta.szlcsc.com/upload/public/pdf/source/20200330/C501008_33845F4706D5CD6F770C8B6D5E0A7DE9.pdf; Supplier: LCSC; Type: N沟道; Drain Source Voltage (Vdss): 60V; Continuous Drain Current (Id): 130A; Power Dissipation (Pd): 4.8W；125W; Drain Source On Resistance (RDS(on)@Vgs,Id): 3.5mΩ@13A,10V; Gate Threshold Voltage (Vgs(th)@Id): 4V@250uA; Total Gate Charge (Qg@Vgs): 42nC@10V; Input Capacitance (Ciss@Vds): 2.6nF@25V; Operating Temperature: -55℃~+175℃@(Tj)
R18-R20 = HoJLR2512-3W-5mR-1%: 电阻类型:采样电阻;阻值:5mΩ;精度:±1%;功率:3W;安装方式:贴片;; LCSC Part Name: 5mΩ ±1% 3W; Supplier Part: C2903482; Manufacturer: Milliohm(毫欧); Supplier Footprint: 2512; JLCPCB Part Class: 扩展库; Datasheet: https://atta.szlcsc.com/upload/public/pdf/source/20211009/7525CABAB363C979E942C1DD41F1FEF0.pdf; Supplier: LCSC; Type: 采样电阻; Tolerance: ±1%; Power(Watts): 3W; Mounting Sytle: 贴片
R21 R30-R33 = 0402WGF1000TCE: 电阻类型:厚膜电阻;阻值:100Ω;精度:±1%;功率:62.5mW;最大工作电压:50V;温度系数:±200ppm/℃;; LCSC Part Name: 100Ω ±1% 62.5mW 厚膜电阻; Supplier Part: C25076; Manufacturer: UNI-ROYAL(厚声); Supplier Footprint: 0402; JLCPCB Part Class: 基础库; Datasheet: https://atta.szlcsc.com/upload/public/pdf/source/20200306/C422600_1E6D84923E4A46A82E41ADD87F860B5C.pdf; Supplier: LCSC; Type: 厚膜电阻; Tolerance: ±1%; Power(Watts): 62.5mW; Overload Voltage (Max): 50V; Temperature Coefficient: ±200ppm/℃; Operating Temperature Range: -55℃~+155℃
R62-R65 = 0402WGF200KTCE: 电阻类型:厚膜电阻;阻值:2Ω;精度:±1%;功率:62.5mW;最大工作电压:50V;温度系数:±200ppm/℃;; LCSC Part Name: 2Ω ±1% 62.5mW 厚膜电阻; Supplier Part: C270630; Manufacturer: UNI-ROYAL(厚声); Supplier Footprint: 0402; JLCPCB Part Class: 扩展库; Datasheet: https://atta.szlcsc.com/upload/public/pdf/source/20200306/C422600_1E6D84923E4A46A82E41ADD87F860B5C.pdf; Supplier: LCSC; Type: 厚膜电阻; Tolerance: ±1%; Power(Watts): 62.5mW; Overload Voltage (Max): 50V; Temperature Coefficient: ±200ppm/℃; Operating Temperature Range: -55℃~+155℃
R70 R71 = RC0402FR-07100KL: 电阻类型:厚膜电阻;阻值:100kΩ;精度:±1%;功率:62.5mW;最大工作电压:50V;温度系数:±100ppm/℃;; LCSC Part Name: 厚膜电阻 100kΩ ±1% 62.5mW; Supplier Part: C60491; Manufacturer: YAGEO(国巨); Supplier Footprint: 0402; JLCPCB Part Class: 扩展库; Datasheet: https://atta.szlcsc.com/upload/public/pdf/source/20180927/C295883_E8D83085EA81BD7DE0B2B681138C15EE.pdf; Supplier: LCSC; Type: 厚膜电阻; Tolerance: ±1%; Power(Watts): 62.5mW; Overload Voltage (Max): 50V; Temperature Coefficient: ±100ppm/℃; Operating Temperature Range: -55℃~+155℃
U8 = LM5050MK-1/NOPB: 输入电压:5V~75V;; Supplier Part: C129323; Manufacturer: TI(德州仪器); Supplier Footprint: TSOT-23-6; JLCPCB Part Class: 扩展库; Datasheet: https://www.ti.com/cn/lit/gpn/lm5050-1-q1; Supplier: LCSC; Input Voltage: 5V~75V; Operating Temperature	-: -40℃~+125℃
U9 U10 = UCC27284QDRQ1: Driven Configuration:Half Bridge Number of Drivers:2 Load Type:MOSFET Supply Voltage:5.5V~16V Supply Voltage:5.5V~16V Peak Output Current(sink):3.5A Peak Output Current(source):2.5A Rise Time:12ns Fall Time:10ns Operating Temperature:-40℃~+125℃ Operating; LCSC Part Name: 半桥 MOSFET 灌电流3.5A 拉电流2.5A; Supplier Part: C3654891; Manufacturer: TI(德州仪器); Supplier Footprint: SOIC-8; JLCPCB Part Class: 扩展库; Supplier: LCSC; Driven Configuration: Half Bridge; Number of Drivers: 2; Load Type: MOSFET; Supply Voltage: 5.5V~16V; Peak Output Current(sink): 3.5A; Peak Output Current(source): 2.5A; Rise Time: 12ns; Fall Time: 10ns; Operating Temperature: -40℃~+125℃
BUZZER1 = HNB09A03: 驱动方式:有源(内含驱动线路);构造类型:电磁式;额定电压:3V;工作电压:1.5V~4.5V;消耗电流:30mA;频率:3kHz;声压(SPL):85dB@10cm;直径(φD):9mm;长度:-;宽度:-;高度:5.5mm;工作温度:-20℃~+70℃;; LCSC Part Name: 电磁式有源一体蜂鸣器HNB09A03; Supplier Part: C96102; Manufacturer: 华能; Supplier Footprint: 插件,D=9mm; JLCPCB Part Class: 扩展库; Datasheet: https://atta.szlcsc.com/upload/public/pdf/source/20170522/1495448326172.pdf; Supplier: LCSC; Oscillator Circuit: 有源(内含驱动线路); Technology Type: 电磁式; Rated Voltage: 3V; Operating Voltage: 1.5V~4.5V; Current Consumption: 30mA; Sound Pressure Level (SPL): 85dB@10cm; Diameter (φD): 9mm; Height: 5.5mm; Operating Temperature: -20℃~+70℃
C39 C42 C44 C46 C48 = CL05B104KO5NNNC: 容值:100nF;精度:±10%;额定电压:16V;材质(温度系数):X7R;; LCSC Part Name: 100nF ±10% 16V; Supplier Part: C1525; Manufacturer: SAMSUNG(三星); Supplier Footprint: 0402; JLCPCB Part Class: 基础库; Datasheet: https://atta.szlcsc.com/upload/public/pdf/source/20160218/1457707763339.pdf; Supplier: LCSC; Tolerance: ±10%; Voltage Rated: 16V; Temperature Coefficient: X7R
CN1 = HC-GH-2PWT_C3011944: 插针结构:1x2P;间距:1.25mm;安装方式:卧贴;参考系列:GH;总PIN数:2P;排数:1;每排PIN数:2;行距:-;额定电流:1A;触头材质:磷青铜;触头镀层:锡;工作温度范围:-25℃~+85℃;; LCSC Part Name: 1x2P 间距:1.25mm 卧贴 系列:GH; Supplier Part: C3011944; Manufacturer: HCTL(华灿天禄); Supplier Footprint: SMD,P=1.25mm,卧贴; JLCPCB Part Class: 扩展库; Datasheet: https://atta.szlcsc.com/upload/public/pdf/source/20210728/C2845397_2BAB5616F3DD52263F1EF5392BF0F2D4.pdf; Supplier: LCSC; Pins Structure: 1x2P; Pitch: 1.25mm; Mounting Style: 卧贴; Reference Series: GH; Number of Pins: 2P; Number of Rows: 1; Number of PINs Per Row: 2; Current Rating (Max): 1A; Contact Material: 磷青铜; Contact Plating: 锡; Operating Temperature Range: -25℃~+85℃
CN2 = HC-1.25-4PWT: 参考系列:-;间距:1.25mm;插针结构:1x4P;排数:1;每排PIN数:4;行距:-;公母:公型插针;安装方式:卧贴;额定电流:1A;工作温度范围:-25℃~+85℃;; LCSC Part Name: 1.25mm1x4P卧贴; Supplier Part: C2845381; Manufacturer: HCTL(华灿天禄); Supplier Footprint: SMD,P=1.25mm; JLCPCB Part Class: 扩展库; Datasheet: https://atta.szlcsc.com/upload/public/pdf/source/20210728/C2845379_48B7DC28A4B35DB030A7253F7C3FD974.pdf; Supplier: LCSC; Pitch: 1.25mm; Pins Structure: 1x4P; Number of Rows: 1; Number of PINs Per Row: 4; Gender: 公型插针; Mounting Style: 卧贴; Current Rating (Max): 1A; Operating Temperature Range: -25℃~+85℃
CN3 CN4 = HC-GH-4PWT_C2845399: 插针结构:1x4P;间距:1.25mm;安装方式:卧贴;参考系列:-;总PIN数:4P;排数:1;每排PIN数:4;行距:-;额定电流:1A;触头材质:磷青铜;触头镀层:锡;工作温度范围:-25℃~+85℃;; LCSC Part Name: 1x4P 间距:1.25mm 卧贴; Supplier Part: C2845399; Manufacturer: HCTL(华灿天禄); Manufacturer Part: HC-GH-4PWT; Supplier Footprint: SMD,P=1.25mm,卧贴; JLCPCB Part Class: 扩展库; Datasheet: https://atta.szlcsc.com/upload/public/pdf/source/20231019/68551EBC7AE35D3AC54804DC204EA813.pdf; Supplier: LCSC; Pins Structure: 1x4P; Pitch: 1.25mm; Mounting Style: 卧贴; Number of Pins: 4P; Number of Rows: 1; Number of PINs Per Row: 4; Current Rating (Max): 1A; Contact Material: 磷青铜; Contact Plating: 锡; Operating Temperature Range: -25℃~+85℃
H6 = HDR-M_2.54_1x5P: Supplier Part: C358687; Supplier Footprint: 插件
H7 H9 H10 H12 H14 = HDR-M_2.54_1x3P: Supplier Part: C2937625; Supplier Footprint: 插件
H13 = HDR-F_2.54_2x3: Supplier Part: C92272; Supplier Footprint: 插件
LED3 = 19-213/Y2C-CQ2R2L/3T(CY): 发光颜色:黄色;功率:60mW;正向电流:20mA;主波长:585.5nm~591.5nm;二极管配置:-;透镜颜色:无色透明透镜;色温:-;发光角度:120°;载带方式:-;工作温度:-40℃~+85℃;; LCSC Part Name: 黄灯; Supplier Part: C72038; Manufacturer: EVERLIGHT(亿光); Supplier Footprint: 0603; JLCPCB Part Class: 基础库; Datasheet: https://atta.szlcsc.com/upload/public/pdf/source/20160507/1462613613586.pdf; Supplier: LCSC; Emitted Color: 黄色; Power Dissipation: 60mW; Forward Current: 20mA; Dominant Wavelength: 585.5nm~591.5nm; Peak Wavelength: 591nm; Lens Color: 无色透明透镜; Viewing Angle: 120°; Operating Temperature: -40℃~+85℃
LED4 LED5 = E6C0805TKAY1UDA: 发光颜色:冰蓝色;功率:-;正向电流:20mA;主波长:-;二极管配置:-;透镜颜色:雾状黄透镜;色温:-;发光角度:120°;载带方式:-;工作温度:-40℃~+90℃;; LCSC Part Name: E6C0805TKAY1UDA 冰蓝/天空蓝; Supplier Part: C2859407; Manufacturer: ekinglux(亿晶源); Supplier Footprint: 0805; JLCPCB Part Class: 扩展库; Datasheet: https://atta.szlcsc.com/upload/public/pdf/source/20210823/60EDF97C974DD75042409A5350B827A6.pdf; Supplier: LCSC; Emitted Color: 冰蓝色; Forward Current: 20mA; Lens Color: 雾状黄透镜; Viewing Angle: 120°; Operating Temperature: -40℃~+90℃
Q6-Q10 = 2N7002_C8545: 类型:N沟道;漏源电压(Vdss):60V;连续漏极电流(Id):115mA;功率(Pd):200mW;导通电阻(RDS(on)@Vgs,Id):7.5Ω@10V,500mA;阈值电压(Vgs(th)@Id):2.5V@250uA;; LCSC Part Name: N沟道 耐压:60V 电流:115mA; Supplier Part: C8545; Manufacturer: CJ(江苏长电/长晶); Supplier Footprint: SOT-23; JLCPCB Part Class: 基础库; Datasheet: https://atta.szlcsc.com/upload/public/pdf/source/20171228/C164913_15144413269051213916.pdf; Supplier: LCSC; Type: N沟道; Drain Source Voltage (Vdss): 60V; Continuous Drain Current (Id): 115mA; Power Dissipation (Pd): 200mW; Drain Source On Resistance (RDS(on)@Vgs,Id): 7.5Ω@10V,500mA; Gate Threshold Voltage (Vgs(th)@Id): 2.5V@250uA
R34 = 0603WAF3300T5E: 电阻类型:厚膜电阻;阻值:330Ω;精度:±1%;功率:100mW;最大工作电压:75V;温度系数:±100ppm/℃;; LCSC Part Name: 330Ω ±1% 100mW 厚膜电阻; Supplier Part: C23138; Manufacturer: UNI-ROYAL(厚声); Supplier Footprint: 0603; JLCPCB Part Class: 基础库; Datasheet: https://atta.szlcsc.com/upload/public/pdf/source/20200306/C422600_1E6D84923E4A46A82E41ADD87F860B5C.pdf; Supplier: LCSC; Type: 厚膜电阻; Tolerance: ±1%; Power(Watts): 100mW; Overload Voltage (Max): 75V; Temperature Coefficient: ±100ppm/℃; Operating Temperature Range: -55℃~+155℃
R40 R41 = 0402WGF2000TCE: 电阻类型:厚膜电阻;阻值:200Ω;精度:±1%;功率:62.5mW;最大工作电压:50V;温度系数:±100ppm/℃;; LCSC Part Name: 200Ω ±1% 62.5mW 厚膜电阻; Supplier Part: C25087; Manufacturer: UNI-ROYAL(厚声); Supplier Footprint: 0402; JLCPCB Part Class: 基础库; Datasheet: https://atta.szlcsc.com/upload/public/pdf/source/20200306/C422600_1E6D84923E4A46A82E41ADD87F860B5C.pdf; Supplier: LCSC; Type: 厚膜电阻; Tolerance: ±1%; Power(Watts): 62.5mW; Overload Voltage (Max): 50V; Temperature Coefficient: ±100ppm/℃; Operating Temperature Range: -55℃~+155℃
R42 R45 R48 R52 R53 R56 R61 = 0402WGF330JTCE: 电阻类型:厚膜电阻;阻值:33Ω;精度:±1%;功率:62.5mW;最大工作电压:50V;温度系数:±100ppm/℃;; LCSC Part Name: 33Ω ±1% 62.5mW 厚膜电阻; Supplier Part: C25105; Manufacturer: UNI-ROYAL(厚声); Supplier Footprint: 0402; JLCPCB Part Class: 基础库; Datasheet: https://atta.szlcsc.com/upload/public/pdf/source/20200306/C422600_1E6D84923E4A46A82E41ADD87F860B5C.pdf; Supplier: LCSC; Type: 厚膜电阻; Tolerance: ±1%; Power(Watts): 62.5mW; Overload Voltage (Max): 50V; Temperature Coefficient: ±100ppm/℃; Operating Temperature Range: -55℃~+155℃
R49 = 0603WAF1200T5E: 电阻类型:厚膜电阻;阻值:120Ω;精度:±1%;功率:100mW;最大工作电压:75V;温度系数:±100ppm/℃;; LCSC Part Name: 120Ω ±1% 100mW 厚膜电阻; Supplier Part: C22787; Manufacturer: UNI-ROYAL(厚声); Supplier Footprint: 0603; JLCPCB Part Class: 基础库; Datasheet: https://atta.szlcsc.com/upload/public/pdf/source/20200306/C422600_1E6D84923E4A46A82E41ADD87F860B5C.pdf; Supplier: LCSC; Type: 厚膜电阻; Tolerance: ±1%; Power(Watts): 100mW; Overload Voltage (Max): 75V; Temperature Coefficient: ±100ppm/℃; Operating Temperature Range: -55℃~+155℃
R68 R69 = 0603WAF0000T5E: 电阻类型:厚膜电阻;阻值:0Ω;精度:±1%;功率:100mW;最大工作电压:75V;; LCSC Part Name: 0Ω ±1% 100mW 厚膜电阻; Supplier Part: C21189; Manufacturer: UNI-ROYAL(厚声); Supplier Footprint: 0603; JLCPCB Part Class: Basic Part; Datasheet: https://atta.szlcsc.com/upload/public/pdf/source/20200306/C422600_1E6D84923E4A46A82E41ADD87F860B5C.pdf; Supplier: LCSC; Type: 厚膜电阻; Tolerance: ±1%; Power(Watts): 100mW; Overload Voltage (Max): 75V; Operating Temperature Range: -55℃~+155℃; Temperature Coefficient: ±100ppm/℃
U11 U12 = XD-GH-3PWT: 插针结构:1x3P;间距:1.25mm;安装方式:卧贴;参考系列:GH;总PIN数:3P;排数:1;每排PIN数:3;额定电流:1A;触头镀层:锡;工作温度范围:-40℃~+105℃;; LCSC Part Name: 1x3P 间距:1.25mm 卧贴 系列:GH; Supplier Part: C17700381; Manufacturer: XUNDA(讯答); Supplier Footprint: SMD,P=1.25mm,卧贴; Datasheet: https://atta.szlcsc.com/upload/public/pdf/source/20231019/0574E105206498063B39A8D5088E5395.pdf; Supplier: LCSC; Pins Structure: 1x3P; Pitch: 1.25mm; Mounting Style: 卧贴; Reference Series: GH; Number of Pins: 3P; Number of Rows: 1; Number of PINs Per Row: 3; Current Rating (Max): 1A; Contact Plating: 锡; Operating Temperature Range: -40℃~+105℃
U13 U14 U16 = INA186A1IDCKR: 放大器数:单路;; Supplier Part: C2058311; Manufacturer: TI(德州仪器); Supplier Footprint: SC-70-6; JLCPCB Part Class: 扩展库; Datasheet: https://www.ti.com/cn/lit/gpn/ina186; Supplier: LCSC; Number of Channels: 单路; Supply Current: 48uA; Operating Temperature: -40℃~+125℃
U15 = SN65HVD232D: 类型:收发器;数据速率:1Mbps;; Supplier Part: C1544356; Manufacturer: TI(德州仪器); Supplier Footprint: SOIC-8; JLCPCB Part Class: 扩展库; Datasheet: https://www.ti.com/cn/lit/gpn/sn65hvd232; Supplier: LCSC; Type: 收发器; Data Rate: 1Mbps; Supply Voltage: 3V~3.6V; Operating Temperature: -40℃~+85℃
U17 = COS722SR: 放大器数:双路;增益带宽积(GBP):10MHz;输入失调电压(Vos):5mV;压摆率(SR):7.5V/us;; Supplier Part: C693063; Manufacturer: COSINE(科山芯创); Supplier Footprint: SOIC-8; JLCPCB Part Class: 扩展库; Datasheet: https://atta.szlcsc.com/upload/public/pdf/source/20200629/C693056_2991DE5392421DDCA1474C8C5608148D.pdf; Supplier: LCSC; Number of Circuits: 双路; Gain Bandwidth Product(GBP): 10MHz; Voltage - Input Offset(Vos): 5mV; Slew Rate(SR): 7.5V/us; Supply Current: 650uA

## Nets
1V65: H10.3 R68.1 U7.1(OUT) U7.4(IN-) U13.1(REF) U14.1(REF) U16.1(REF)
3V3: BUZZER1.1(+) C1.2 C2.2 C3.2 C20.1 C44.1 C54.2 C55.2 C56.2 CN2.4 D1.2 D14.1(K) H1.1 H7.2 L2.1 L3.1 LED2.2(A) LED3.2(A) LED4.2(A) LED5.2(A) LED6.2(A) R2.2 U2.6(VBAT) U2.24(VDD) U2.49(VDD) U2.64(VDD) U2.75(VDD) U2.100(VDD) U6.2(OUT) U15.3(VCC)
6V84: C12.2 C13.2 C18.2 C19.1 C27.2 C28.2 C33.2 C34.2 D2.2(A) H1.2 L5.2 R5.1 U6.3(IN) U9.1(VDD) U10.1(VDD)
24V: D10.1 R18.1 R50.2 U3.2(+) U13.4(IN+)
GND: C12.1 C13.1 C14.1 C15.1 C16.1 C17.1 C24.2 C25.2 C26.1 C27.1 C28.1 C33.1 C34.1 D3.1(A) D4.1(A) D5.1(A) D6.1(A) D7.1(A) D10.2 H12.1 H12.2 H12.3 Q4.1(S) Q4.2(S) Q4.3(S) Q5.1(S) Q5.2(S) Q5.3(S) Q6.2(S) Q7.2(S) Q8.2(S) R6.1 R8.2 R9.2 R10.2 R12.1 R13.2 R14.1 R15.1 R17.1 R28.1 R29.1 R37.1 R38.1 R39.1 R71.1 U1.1(-) U3.1(-) U4.1(-) U5.9(GND) U8.2(GND) U9.7(VSS) U10.7(VSS) U18.1(-)
PGND: C1.1 C2.1 C3.1 C8.1 C9.1 C10.2 C19.2 C20.2 C21.2 C23.2 C30.2 C31.2 C36.2 C37.2 C39.2 C40.1 C41.1 C42.2 C43.1 C44.2 C45.1 C46.2 C47.1 C48.2 C49.1 C50.1 C51.1 C52.1 C53.1 C54.1 C55.1 C56.1 CN1.3 CN1.4 CN2.3 CN2.5 CN2.6 CN3.3 CN3.5 CN3.6 CN4.3 CN4.5 CN4.6 D1.1 D15.1 D16.1 D17.1 D18.1 D19.1 D20.1 D21.1 D22.1 D23.1 H9.1 H9.2 H9.3 H10.1 H14.1 H14.2 H14.3 Q9.2(S) Q10.2(S) R1.1 R7.2 R8.1 R9.1 R10.1 R12.2 R13.1 R14.2 R15.2 R16.2 R17.2 R43.1 R44.1 R46.1 R51.1 R54.1 R57.1 R59.1 R69.1 SW1.3(C) SW1.4(D) U2.23(VSS) U2.35(VSSA) U2.48(VSS) U2.63(VSS) U2.74(VSS) U2.99(VSS) U6.1(GND) U7.2(V-) U11.1 U11.4 U11.5 U12.1 U12.4 U12.5 U13.2(GND) U14.2(GND) U15.2(GND) U16.2(GND) U17.4(-VS) X1.2(GND) X1.4(GND)
VDDA: C51.2 L3.2 U2.36(VREF+) U2.37(VDDA)
ADC1_IN1: C40.2 D15.2 H13.3 R42.2 U2.20(PA0)
ADC1_IN2: C43.2 D16.2 H13.1 R45.2 U2.21(PA1)
ADC2_IN11: U2.31(PC5) U17.1(OUTA) U17.2(-IN1)
ADC2_IN12: C41.2 D17.2 H13.2 R48.2 U2.34(PB2)
ADC2_IN13: U2.27(PA5) U17.6(-IN2) U17.7(OUTB)
ADC3_IN2: C47.2 D19.2 H13.5 R53.2 U2.40(PE9)
ADC3_IN4: C45.2 D18.2 H13.4 R52.2 U2.38(PE7)
ADC3_IN6: C49.2 D20.2 H13.6 R56.2 U2.39(PE8)
ADC4_IN3: C52.2 D22.2 R68.2 U2.51(PB12)
ADC4_IN12: C50.2 D21.2 R61.2 U2.55(PD8)
AUXVoltageInput: C14.2 C15.2 C16.2 D3.2(K) D4.2(K) D5.2(K) D6.2(K) D7.2(K) FH1.1 Q11.5(D) Q11.6(D) Q11.7(D) Q11.8(D) R3.2 R4.2 R66.1 R67.1 U4.2(+) U5.2(IN)
BUZZER: H5.1 Q6.1(G) R37.2 U2.1(PE2)
C_CAP+: R20.1 U1.2(+) U16.4(IN+) U18.2(+)
C_CAP-: C25.1 Q3.5(D) Q3.6(D) Q3.7(D) Q3.8(D) R20.2 R47.2 R60.2 U16.5(IN-)
C_LEFT+: FH1.2 R19.1 U14.4(IN+)
C_LEFT-: C24.1 Q2.5(D) Q2.6(D) Q2.7(D) Q2.8(D) R19.2 R55.2 R58.2 U14.5(IN-)
C_SYS-: Q11.1(S) Q11.2(S) Q11.3(S) R18.2 R66.2 R67.2 R70.1 U8.4(IN) U13.5(IN-)
CAN1H: CN1.2 R49.2 U15.7(CANH)
CAN1L: CN1.1 R49.1 U15.6(CANL)
CAN1R: U2.72(PA11) U15.4(R)
CAN1T: U2.73(PA12) U15.1(D)
LED_0: H5.2 Q7.1(G) R38.2 U2.2(PE3)
LED_1: Q8.1(G) R39.2 U2.3(PE4)
LED_B_0: Q9.1(G) R43.2 U2.59(PD12)
LED_B_1: Q10.1(G) R44.2 U2.60(PD13)
LEFT_HG: D8.1(K) R63.1 U9.3(HO)
LEFT_LG: D12.1(K) R62.1 U9.8(LO)
LEFT_M: C29.1 C32.1 L4.2 Q2.1(S) Q2.2(S) Q2.3(S) Q4.5(D) Q4.6(D) Q4.7(D) Q4.8(D) R24.1 U9.4(HS)
PA8: C53.2 D23.2 H6.1 R69.2 U2.69(PA8)
PC6: H6.5 U2.65(PC6)
PC7: H6.4 U2.66(PC7)
PC8: H6.3 U2.67(PC8)
PC9: H6.2 U2.68(PC9)
PIO_0: H7.3 U2.53(PB14)
PIO_1: H7.1 U2.54(PB15)
REF3V3: C21.1 C39.1 C42.1 C46.1 C48.1 L2.2 R11.1 U7.5(V+) U13.3(VS) U14.3(VS) U16.3(VS) U17.8(+VS)
RESET: C9.2 R2.1 SW1.1(A) SW1.2(B) U2.14(PG10-NRST)
RIGHT_HG: D9.1(K) R64.2 U10.3(HO)
RIGHT_LG: D13.1(K) R65.2 U10.8(LO)
RIGHT_M: C35.1 C38.1 L4.1 Q3.1(S) Q3.2(S) Q3.3(S) Q5.5(D) Q5.6(D) Q5.7(D) Q5.8(D) R25.1 U10.4(HS)
SWCLK: CN2.2 U2.77(PA14)
SWDIO: CN2.1 U2.76(PA13)
TIM1_CH1: H8.2 R31.1 U2.15(PC0)
TIM1_CH1N: H8.1 R30.1 U2.7(PC13)
TIM1_CH4: H11.1 R32.1 U2.45(PE14)
TIM1_CH4N: H11.2 R33.1 U2.46(PE15)
USART1_R: CN3.1 U2.71(PA10)
USART1_T: CN3.2 U2.70(PA9)
USART2_R: CN4.2 U2.88(PD6)
USART2_T: CN4.1 U2.87(PD5)
USART3_R: U2.80(PC11) U11.3 U12.2
USART3_T: U2.79(PC10) U11.2 U12.3
$1N1583: C11.1 U5.7(BS)
$1N1592: C11.2 L5.1 U5.8(LX)
$1N2384: R4.1 U5.4(RON)
$1N2800: C17.2 D2.1(C) U5.6(VCC)
$1N3273: C18.1 R5.2 R6.2 U5.5(FB)
$1N3553: R3.1 U5.3(EN)
$1N4814: C23.1 R11.2 R16.1 U7.3(IN+)
$1N6924: LED6.1(K) R7.1
$1N7417: R1.2 U2.95(PB8-BOOT0)
$1N13350: C8.2 U2.12(PF0-OSC_IN) X1.3(OSC2)
$1N13370: C10.1 U2.13(PF1-OSC_OUT) X1.1(OSC1)
$2N4548: C37.1 R33.2 U10.5(HI)
$2N4948: C30.1 R30.2 U9.6(LI)
$2N4950: C31.1 R31.2 U9.5(HI)
$2N5889: C35.2 C38.2 U10.2(HB)
$2N5937: C29.2 C32.2 U9.2(HB)
$2N20281: C36.1 R32.2 U10.6(LI)
$2N20527: D8.2(A) Q2.4(G) R24.2 R63.2
$2N20631: D12.2(A) Q4.4(G) R28.2 R62.2
$2N20845: D9.2(A) Q3.4(G) R25.2 R64.1
$2N21567: C26.2 R21.1 U8.1(VS)
$2N24690: R21.2 U8.6(OUT)
$2N24699: Q11.4(G) U8.5(GATE)
$2N25292: D13.2(A) Q5.4(G) R29.2 R65.1
$2N31679: R70.2 R71.2 U8.3(OFF)
$3N1263: Q7.3(D) R35.1
$3N1304: Q8.3(D) R36.1
$3N1497: LED2.1(K) R35.2
$3N1507: LED3.1(C) R36.2
$3N1591: LED4.1(K) R40.2
$3N1597: Q9.3(D) R40.1
$3N1755: LED5.1(K) R41.2
$3N1757: Q10.3(D) R41.1
$3N5586: BUZZER1.2(-) D14.2(A) R34.2
$3N5630: Q6.3(D) R34.1
$3N7028: R53.1 U16.6(OUT)
$3N7040: R46.2 R47.1 R48.1
$3N7048: R50.1 R51.2 R52.1
$3N7064: R54.2 R55.1 R56.1
$3N7241: H10.2 R61.1
$3N7569: R57.2 R58.1 U17.3(+IN1)
$3N7670: R59.2 R60.1 U17.5(+IN2)
$3N11588: R45.1 U13.6(OUT)
$3N11591: R42.1 U14.6(OUT)

Not connected (* = marked no-connect by the designer): CN3 4*; CN4 4*; L4 3*; U2 4(PE5)* 5(PE6)* 8(PC14-OSC32_IN)* 9(PC15-OSC32_OUT)* 10(PF9)* 11(PF10)* 16(PC1)* 17(PC2)* 18(PC3)* 19(PF2)* 22(PA2)* 25(PA3)* 26(PA4)* 28(PA6)* 29(PA7)* 30(PC4)* 32(PB0)* 33(PB1)* 41(PE10)* 42(PE11)* 43(PE12)* 44(PE13)* 47(PB10)* 50(PB11)* 52(PB13)* 56(PD9)* 57(PD10)* 58(PD11)* 61(PD14)* 62(PD15)* 78(PA15)* 81(PC12)* 82(PD0)* 83(PD1)* 84(PD2)* 85(PD3)* 86(PD4)* 89(PD7)* 90(PB3)* 91(PB4)* 92(PB5)* 93(PB6)* 94(PB7)* 96(PB9)* 97(PE0)* 98(PE1)*; U5 1(NC)*; U15 5(NC)* 8(NC)*

## Notes on the sheets
sheet 1
- RED - 3.3V
- Power Tree
- F = 550kHz
  R_on = 1M
  V_out = 6.84V
  I = 0.5A
  C_in = 213n
  L > 41u
- PA8 = ADC5_IN1
  实验：数字信号对于ADC的影响
- V_cap
- V_bat
  V_sys
  C_right
- 本接口用来研究500k开关信号对于PWM的影响
- AUX voltage
sheet 2
- short at init →
- Estimation Power in this resistor: 1W
  Max current: 10A
- 做个上拉以防后悔
- 光速翼说这个可能会烧电调
  需要研究一下
- F = 500kHz
  Qg = 65nC
  Cboot = 32nF
- 1.6MHz low pass filter
- 1.6MHz low pass filter
sheet 3
- 200kHz low pass filter
- 200kHz low pass filter
- 这个地方使用PGND是因为没地方放了
- 如果可以的话记得研究这个地方应该接地还是PGND
